# Altium project Rangkaian_sederhana.PrjPcb
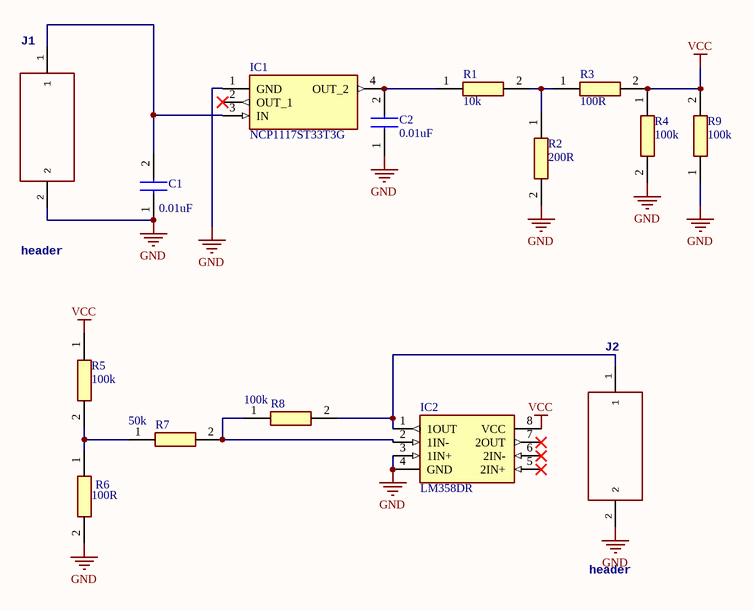
[diagram p0: Schematik_rangkaian.SchDoc]
1 sheet, 15 parts. Net scope: global (net labels, ports and power ports of the same name join across sheets).
Board file: schematik_rangkaian.PcbDoc

## Sheet Schematik_rangkaian.SchDoc
size A4

### Parts
C1  0.01uF  [0805_CAP_STD]
C2  0.01uF  [0805_CAP_STD]
IC1  NCP1117ST33T3G  [SOT230P700X180-4N]
IC2  LM358DR  [SOIC127P600X175-8N]
J1  header  [SAMTEC-TMM-101-05-X-D]
J2  header  [SAMTEC-TMM-101-05-X-D]
R1  10k  [RESC2012X65N]
R2  200R  [RESC2012X65N]
R3  100R  [RESC2012X65N]
R4  100k  [RESC2012X65N]
R5  100k  [RESC2012X65N]
R6  100R  [RESC2012X65N]
R7  50k  [RESC2012X65N]
R8  100k  [RESC2012X65N]
R9  100k  [RESC2012X65N]

### Nets
GND: C1.1 C2.1 IC1.1(GND) IC2.3(1IN+) IC2.4(GND) J1.2 J2.2 R2.2 R4.2 R6.2 R9.1
VCC: IC2.8(VCC) R3.2 R4.1 R5.1 R9.2
NetC1_2: C1.2 IC1.3(IN) J1.1
NetC2_2: C2.2 IC1.4(OUT_2) R1.1
NetIC2_1: IC2.1(1OUT) J2.1 R8.2
NetIC2_2: IC2.2(1IN-) R7.2 R8.1
NetR1_2: R1.2 R2.1 R3.1
NetR5_2: R5.2 R6.1 R7.1

Not connected (* = marked no-connect by the designer): IC1 2(OUT_1)*; IC2 5(2IN+)* 6(2IN-)* 7(2OUT)*

### Library data of the parts
C1 C2 = 08055A130JAQ2A: Capacitor; Manufacturer_Name: AVX; Datasheet Link: https://componentsearchengine.com/Datasheets/1/06031A100FAT2A.pdf; Height: 0.94mm; Manufacturer_Part_Number: 08055A130JAQ2A; Mouser Part Number: 581-08055A130JAQ2A; Mouser Price/Stock: http://www.mouser.com/Search/ProductDetail.aspx?qs=bb%252b1MDm7h6LP6YczTxaOqA%3d%3d
IC1 = NCP1117ST33T3G: Integrated Circuit; Manufacturer_Name: ON Semiconductor; Allied_Number: 70340559; Datasheet Link: http://www.onsemi.com/pub/Collateral/NCP1117-D.PDF; Height: 1.8mm; Manufacturer_Part_Number: NCP1117ST33T3G; Mouser Part Number: 863-NCP1117ST33T3G; Mouser Price/Stock: https://www.mouser.com/Search/Refine.aspx?Keyword=863-NCP1117ST33T3G; RS Part Number: 7857207P; RS Price/Stock: http://uk.rs-online.com/web/p/products/7857207P; Allied Price/Stock: http://www.alliedelec.com/on-semiconductor-ncp1117st33t3g/70340559/
IC2 = LM358DR: Integrated Circuit; Manufacturer_Name: Texas Instruments; Datasheet Link: http://docs-emea.rs-online.com/webdocs/13f6/0900766b813f612f.pdf; Height: 1.75mm; Manufacturer_Part_Number: LM358DR; Mouser Part Number: 595-LM358DR; Mouser Price/Stock: https://www.mouser.com/Search/Refine.aspx?Keyword=595-LM358DR; RS Part Number: 0527154; RS Price/Stock: http://uk.rs-online.com/web/p/products/0527154
J1 J2 = SAMTEC-TMM-101-05-X-DJ
R1-R9 = CPF0805B100KE: Resistor; Manufacturer_Name: TE Connectivity; Allied_Number: 70286772; Datasheet Link: http://docs-europe.electrocomponents.com/webdocs/13d1/0900766b813d116f.pdf; Height: 0.65mm; Manufacturer_Part_Number: CPF0805B100KE; Mouser Part Number: 279-CPF0805B100KE; Mouser Price/Stock: https://www.mouser.com/Search/Refine.aspx?Keyword=279-CPF0805B100KE; RS Part Number: 6662673P; RS Price/Stock: http://uk.rs-online.com/web/p/products/6662673P; Allied Price/Stock: https://www.alliedelec.com/te-connectivity-cpf0805b100ke/70286772/